# Altium schematic sheet Wifi, Cellular, MD and FRAM.SchDoc
size A4; SheetNumber: 5; SheetTotal: 7
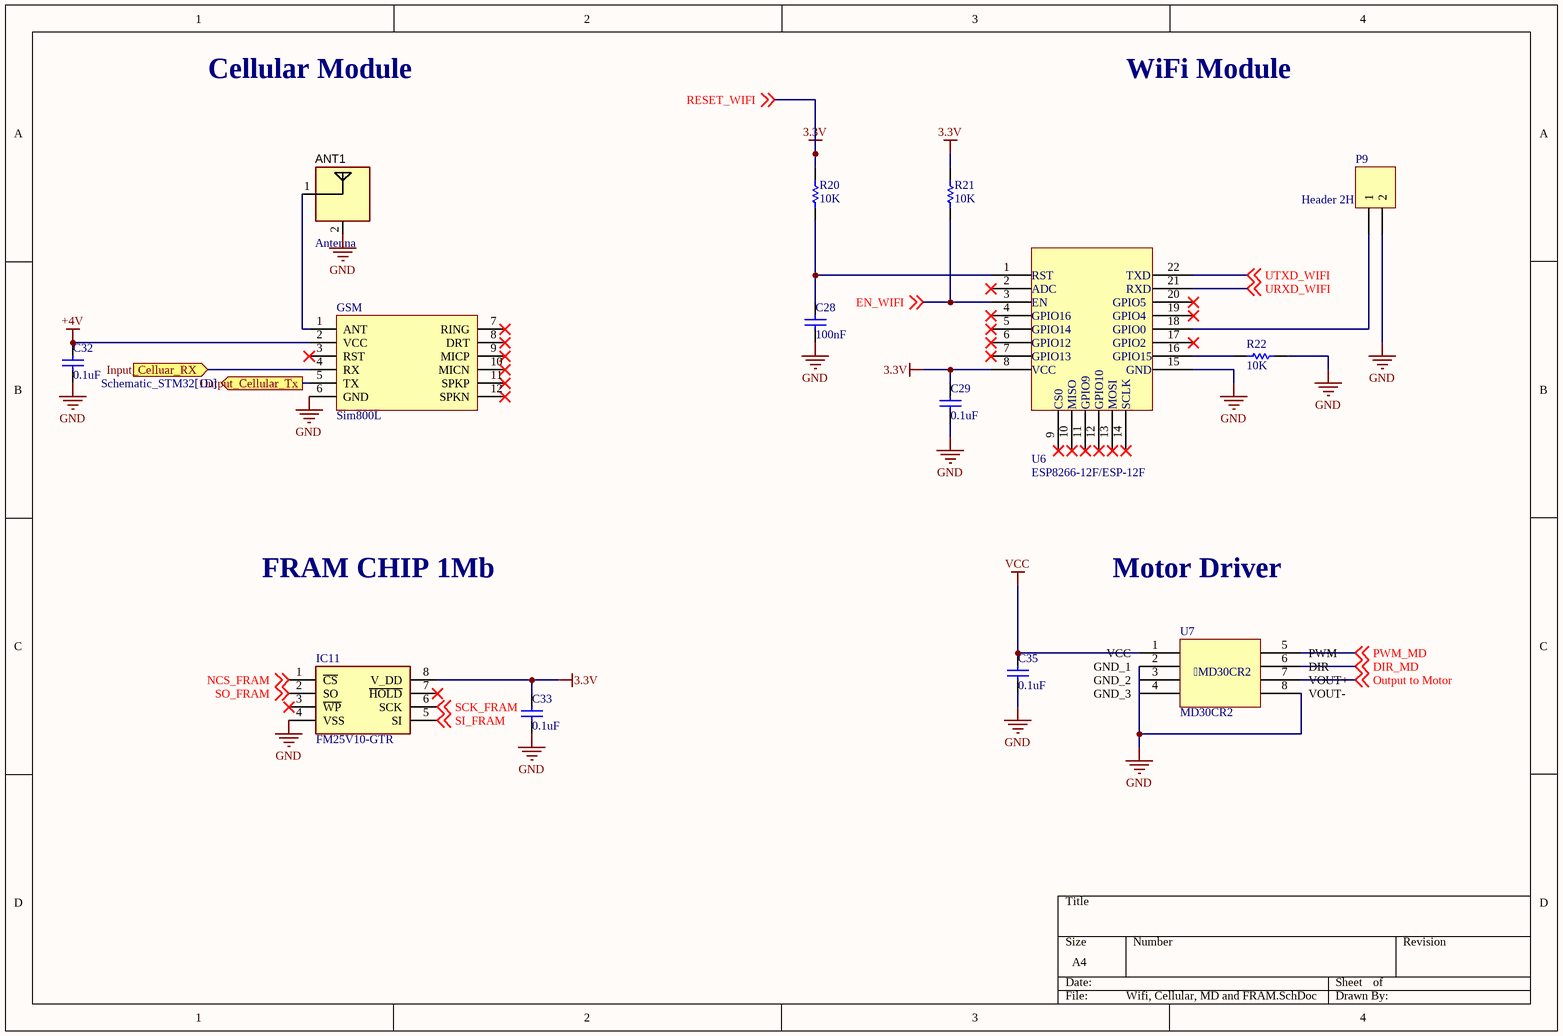
[diagram p0: Wifi, Cellular, MD and FRAM.SchDoc]

## Parts
ANT1  value Antenna  [ANT_IFA_2P4G]  (no BOM)
C28  value 100nF  [RAD-0.3]  (hidden comment: Cap)
C29  value 0.1uF  [RAD-0.3]  (hidden comment: Cap)
C32  value 0.1uF  [RAD-0.3]  (hidden comment: Cap)
C33  value 0.1uF  [RAD-0.3]  (hidden comment: Cap)
C35  value 0.1uF  [RAD-0.3]  (hidden comment: Cap)
GSM  Sim800L  [Sim800L]
IC11  FM25V10-GTR  [SOIC127P602X173-8N]
P9  Header 2H  [HDR1X2H]
R20  value 10K  [AXIAL-0.3]  (hidden comment: Res1)
R21  value 10K  [AXIAL-0.3]  (hidden comment: Res1)
R22  value 10K  [AXIAL-0.3]  (hidden comment: Res1)
U6  ESP8266-12F/ESP-12F
U7  MD30CR2

## Ports
Input_Celluar_RX (in), Output_Cellular_Tx (out, see Schematic_STM32[1D])

## Nets
3.3V: C29.2 C33.2 IC11.8(V_DD) R20.1 R21.1 ; off-sheet RESET_WIFI  [also labelled RESET_WIFI]
+4V: C32.2 GSM.2(VCC)
GND: ANT1.2(GND) C28.1 C29.1 C32.1 C33.1 C35.1 GSM.6(GND) IC11.4(VSS) P9.2 R22.2
VCC: C35.2
EN_WIFI: R21.2 ; off-sheet EN_WIFI
Input_Celluar_RX: GSM.4(RX) ; port Input_Celluar_RX
NCS_FRAM: IC11.1(~{CS}) ; off-sheet NCS_FRAM
Output_Cellular_Tx: GSM.5(TX) ; port Output_Cellular_Tx
SCK_FRAM: IC11.6(SCK) ; off-sheet SCK_FRAM
SI_FRAM: IC11.5(SI) ; off-sheet SI_FRAM
SO_FRAM: IC11.2(SO) ; off-sheet SO_FRAM
NetANT1_1: ANT1.1 GSM.1(ANT)
NetC28_2: C28.2 R20.2

Not connected (* = marked no-connect by the designer): GSM 3(RST)* 7(RING)* 8(DRT)* 9(MICP)* 10(MICN)* 11(SPKP)* 12(SPKN)*; IC11 3(~{WP})* 7(~{HOLD})*; P9 1; R22 1; U6 1(RST) 2(ADC) 3(EN) 4(GPIO16) 5(GPIO14) 6(GPIO12) 7(GPIO13) 8(VCC) 9(CS0) 10(MISO) 11(8) 12(8) 13(8) 14(8) 15(GND) 16(GPIO15) 17(GPIO2) 18(GPIO0) 19(GPIO4) 20(GPIO5) 21(RXD) 22(TXD); U7 1(VCC) 2(GND_1) 3(GND_2) 4(GND_3) 5(PWM) 6(DIR) 7(VOUT+) 8(VOUT-)

## Notes on the sheet
- Cellular Module
- WiFi Module
- FRAM CHIP 1Mb
- Motor Driver
- (in symbol ESP-12F) GPIO9; GPIO10; MOSI; SCLK

## Library data of the parts
ANT1 = TESTPOINT_SMD: TEST POINT; MANF: MANF; MANF_P#: MANF_P#
C28 C29 C32 C33 C35 = Cap: Capacitor; Published: 8-Jun-2000; LatestRevisionDate: 17-Jul-2002; LatestRevisionNote: Re-released for DXP Platform.; PackageReference: RAD-0.3; Publisher: Altium Limited; PackageDescription: Radial Cap, Thru-Hole; 2 Leads; 0.3 in Pin Spacing
GSM = Sim800L: GSM SIM800L
IC11 = FM25V10-GTR: Integrated Circuit; Manufacturer_Name: Infineon; Datasheet Link: https://www.cypress.com/file/41691/download; Height: 1.727mm; Manufacturer_Part_Number: FM25V10-GTR; Mouser Part Number: 877-FM25V10-GTR; Mouser Price/Stock: https://www.mouser.co.uk/ProductDetail/Infineon-Technologies/FM25V10-GTR?qs=pA5MXup5wxEkqZoPzJHFgA%3D%3D; Arrow Part Number: FM25V10-GTR; Arrow Price/Stock: https://www.arrow.com/en/products/fm25v10-gtr/cypress-semiconductor
P9 = Header 2H: Header, 2-Pin, Right Angle; LatestRevisionDate: 17-Jul-2002; LatestRevisionNote: Re-released for DXP Platform.; Publisher: Altium Limited
R20-R22 = Res1: Resistor; Published: 8-Jun-2000; LatestRevisionDate: 17-Jul-2002; LatestRevisionNote: Re-released for DXP Platform.; PackageReference: AXIAL-0.3; Publisher: Altium Limited; PackageDescription: Axial Device, Thru-Hole; 2 Leads; 0.3 in Pin Spacing
U6 = ESP-12F: Integrated Circuit; MODEL NO: ESP8266 ESP-12F WiFi Module; Module's dimensions: 24mm x 16mm x 3.4mm (0.95" x 0.63" x 0.13")
U7 = MD30CR2: Motor Driver; Datasheet: https://robu.in/wp-content/uploads/2014/12/MD30C-Users-Manual-Google-Docs.pdf